# Altium schematic sheet DRS4.SchDoc: My title
size A3; Organization: University of California; Address1: 475 Portola Plaza; Address2: Los Angeles, CA 90095; Revision: R01; SheetNumber: 1; SheetTotal: 1
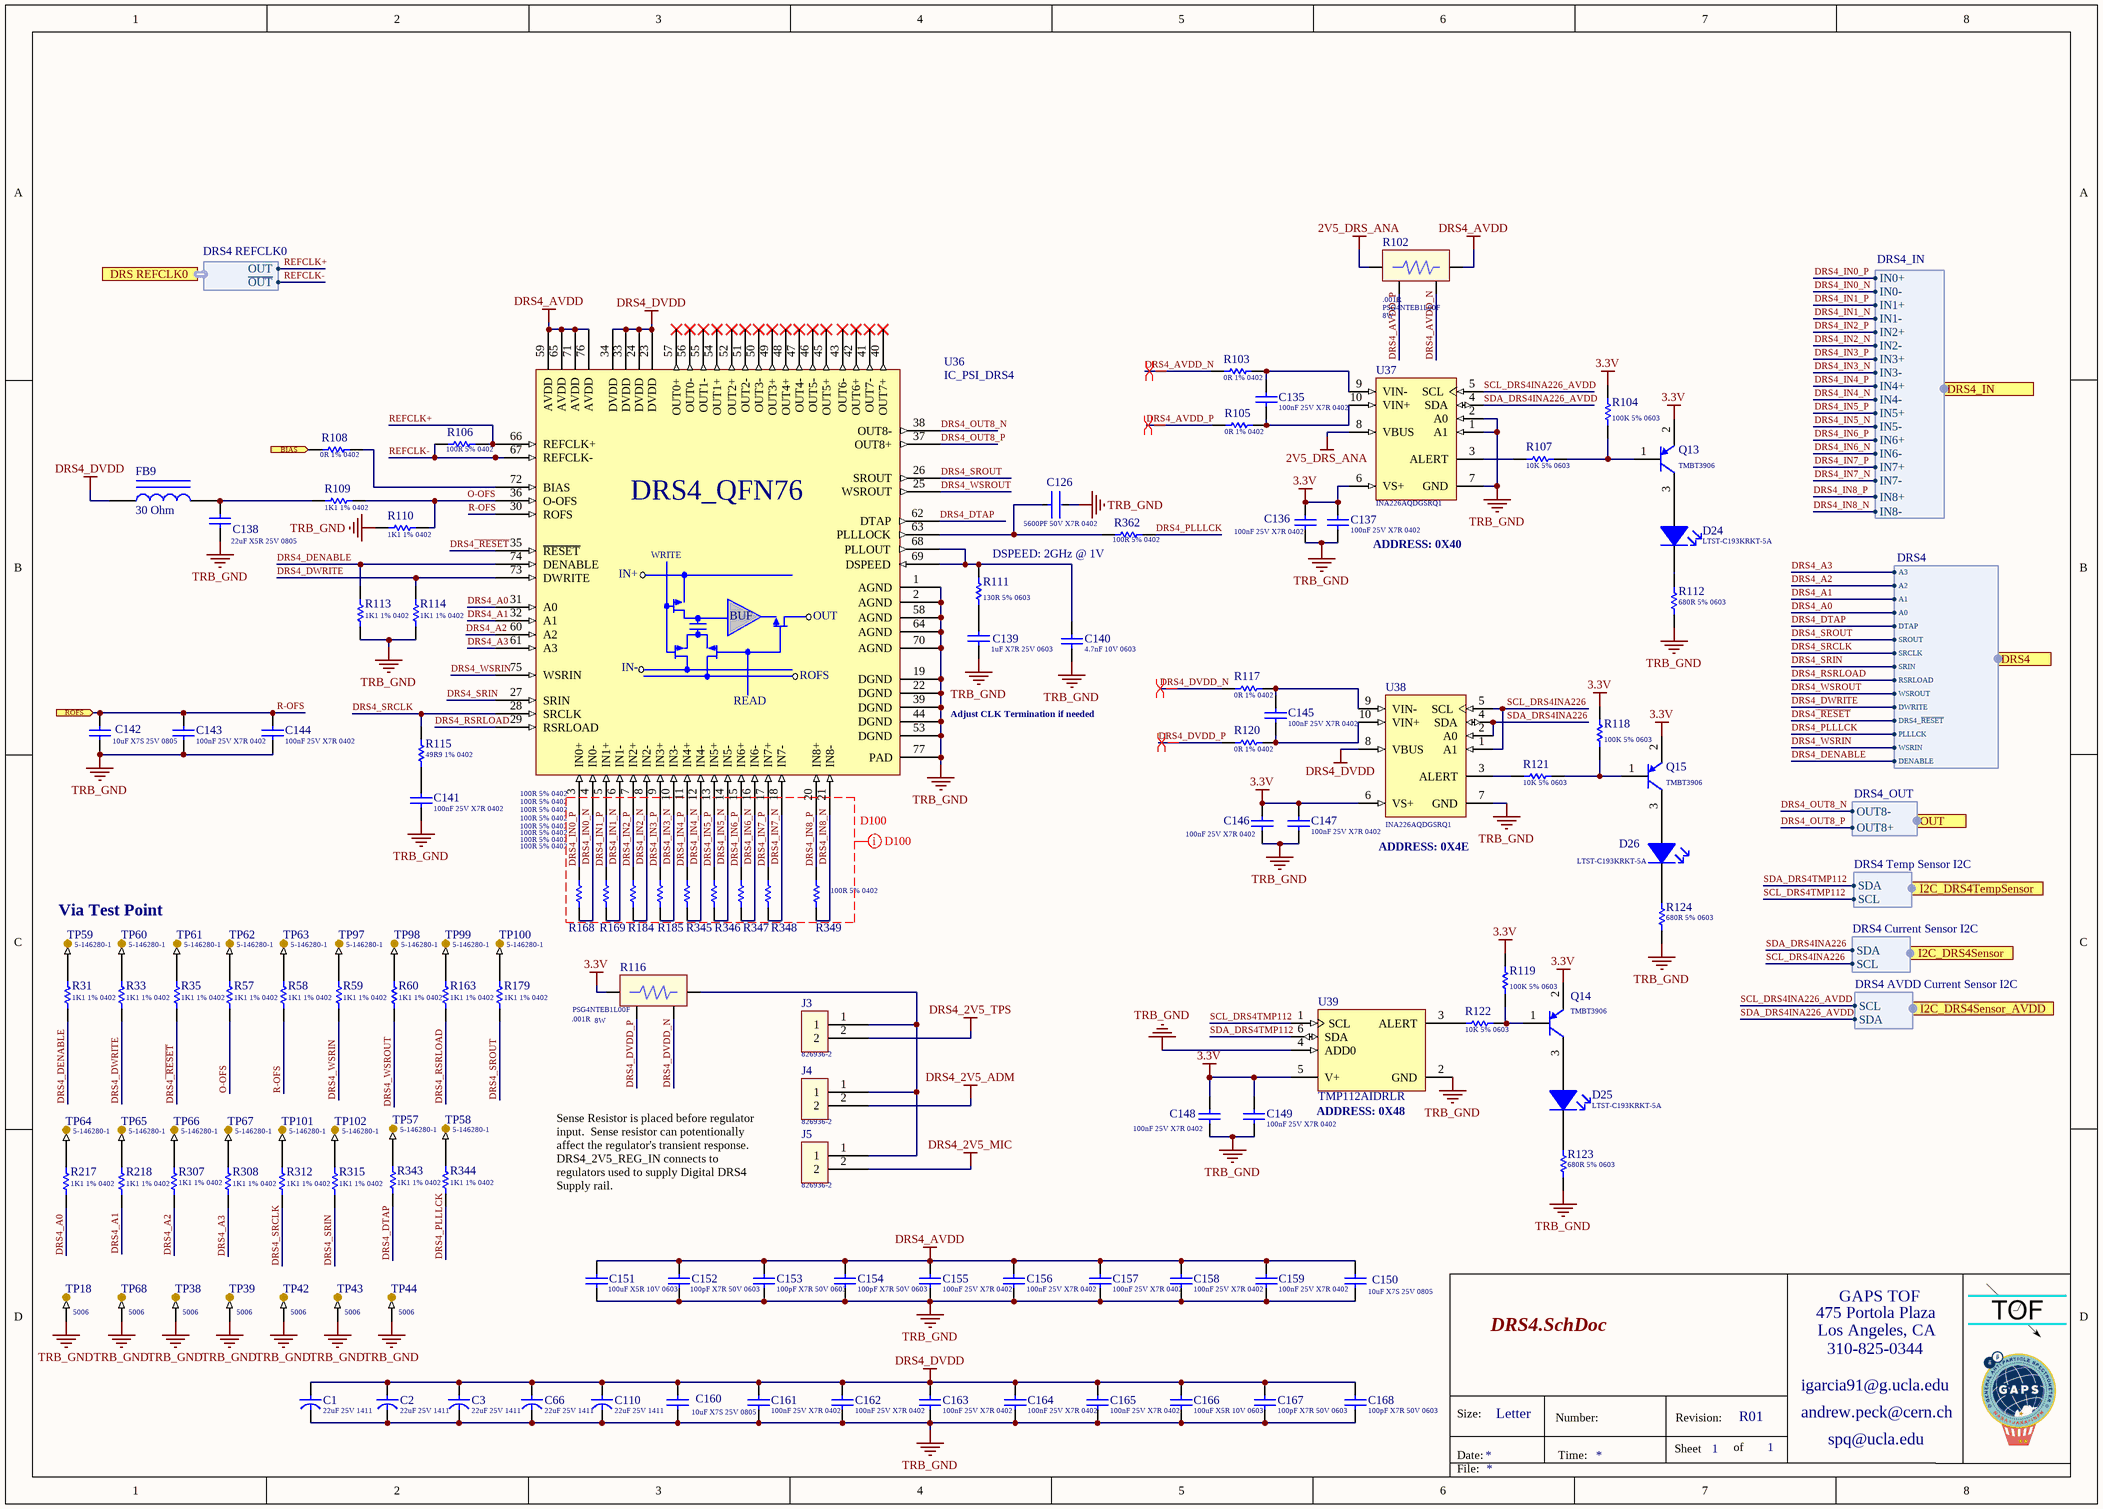
[diagram p0: DRS4.SchDoc]

## Parts
C1  Capacitance: 22uF 25V 1411  [Cap_Kemet_T521B226M025ATE100_22uF]  (hidden comment: Cap_Kemet_T521B226M025ATE100_22uF)
C2  Capacitance: 22uF 25V 1411  [Cap_Kemet_T521B226M025ATE100_22uF]  (hidden comment: Cap_Kemet_T521B226M025ATE100_22uF)
C3  Capacitance: 22uF 25V 1411  [Cap_Kemet_T521B226M025ATE100_22uF]  (hidden comment: Cap_Kemet_T521B226M025ATE100_22uF)
C66  Capacitance: 22uF 25V 1411  [Cap_Kemet_T521B226M025ATE100_22uF]  (hidden comment: Cap_Kemet_T521B226M025ATE100_22uF)
C110  Capacitance: 22uF 25V 1411  [Cap_Kemet_T521B226M025ATE100_22uF]  (hidden comment: Cap_Kemet_T521B226M025ATE100_22uF)
C126  5600PF 50V X7R 0402  [FP-C0402-BB-MFG]
C135  Capacitance: 100nF 25V X7R 0402  [Cap_Taiyo_Yuden_TMK105B7104KV-FR_100nF]  (hidden comment: Cap_Taiyo_Yuden_TMK105B7104KV-FR_100nF)
C136  Capacitance: 100nF 25V X7R 0402  [Cap_Taiyo_Yuden_TMK105B7104KV-FR_100nF]  (hidden comment: Cap_Taiyo_Yuden_TMK105B7104KV-FR_100nF)
C137  Capacitance: 100nF 25V X7R 0402  [Cap_Taiyo_Yuden_TMK105B7104KV-FR_100nF]  (hidden comment: Cap_Taiyo_Yuden_TMK105B7104KV-FR_100nF)
C138  Capacitance: 22uF X5R 25V 0805  [Cap_Murata_GRT21BR61E226ME13L_22uF]  (hidden comment: Cap_Murata_GRT21BR61E226ME13L_22uF)
C139  Capacitance: 1uF X7R 25V 0603  [Cap_Murata_GCJ188R71E105KA01J_1uF]  (hidden comment: Cap_Murata_GCJ188R71E105KA01J_1uF)
C140  4.7nF 10V 0603  [CAPC0603(1608)100_L]
C141  Capacitance: 100nF 25V X7R 0402  [Cap_Taiyo_Yuden_TMK105B7104KV-FR_100nF]  (hidden comment: Cap_Taiyo_Yuden_TMK105B7104KV-FR_100nF)
C142  Capacitance: 10uF X7S 25V 0805  [Cap_Murata_ GRM21BC71E106ME11L_10uF]  (hidden comment: Cap_Murata_ GRM21BC71E106ME11L_10uF)
C143  Capacitance: 100nF 25V X7R 0402  [Cap_Taiyo_Yuden_TMK105B7104KV-FR_100nF]  (hidden comment: Cap_Taiyo_Yuden_TMK105B7104KV-FR_100nF)
C144  Capacitance: 100nF 25V X7R 0402  [Cap_Taiyo_Yuden_TMK105B7104KV-FR_100nF]  (hidden comment: Cap_Taiyo_Yuden_TMK105B7104KV-FR_100nF)
C145  Capacitance: 100nF 25V X7R 0402  [Cap_Taiyo_Yuden_TMK105B7104KV-FR_100nF]  (hidden comment: Cap_Taiyo_Yuden_TMK105B7104KV-FR_100nF)
C146  Capacitance: 100nF 25V X7R 0402  [Cap_Taiyo_Yuden_TMK105B7104KV-FR_100nF]  (hidden comment: Cap_Taiyo_Yuden_TMK105B7104KV-FR_100nF)
C147  Capacitance: 100nF 25V X7R 0402  [Cap_Taiyo_Yuden_TMK105B7104KV-FR_100nF]  (hidden comment: Cap_Taiyo_Yuden_TMK105B7104KV-FR_100nF)
C148  Capacitance: 100nF 25V X7R 0402  [Cap_Taiyo_Yuden_TMK105B7104KV-FR_100nF]  (hidden comment: Cap_Taiyo_Yuden_TMK105B7104KV-FR_100nF)
C149  Capacitance: 100nF 25V X7R 0402  [Cap_Taiyo_Yuden_TMK105B7104KV-FR_100nF]  (hidden comment: Cap_Taiyo_Yuden_TMK105B7104KV-FR_100nF)
C150  Capacitance: 10uF X7S 25V 0805  [Cap_Murata_ GRM21BC71E106ME11L_10uF]  (hidden comment: Cap_Murata_ GRM21BC71E106ME11L_10uF)
C151  Capacitance: 100uF X5R 10V 0603  [Cap_Murata_GRM31CR61A107ME05L_100uF]  (hidden comment: Cap_Murata_GRM31CR61A107ME05L_100uF)
C152  Capacitance: 100pF X7R 50V 0603  [Cap_Kemet_C0603C101J5RACTU_100pF]  (hidden comment: Cap_Kemet_C0603C101J5RACTU_100pF)
C153  Capacitance: 100pF X7R 50V 0603  [Cap_Kemet_C0603C101J5RACTU_100pF]  (hidden comment: Cap_Kemet_C0603C101J5RACTU_100pF)
C154  Capacitance: 100pF X7R 50V 0603  [Cap_Kemet_C0603C101J5RACTU_100pF]  (hidden comment: Cap_Kemet_C0603C101J5RACTU_100pF)
C155  Capacitance: 100nF 25V X7R 0402  [Cap_Taiyo_Yuden_TMK105B7104KV-FR_100nF]  (hidden comment: Cap_Taiyo_Yuden_TMK105B7104KV-FR_100nF)
C156  Capacitance: 100nF 25V X7R 0402  [Cap_Taiyo_Yuden_TMK105B7104KV-FR_100nF]  (hidden comment: Cap_Taiyo_Yuden_TMK105B7104KV-FR_100nF)
C157  Capacitance: 100nF 25V X7R 0402  [Cap_Taiyo_Yuden_TMK105B7104KV-FR_100nF]  (hidden comment: Cap_Taiyo_Yuden_TMK105B7104KV-FR_100nF)
C158  Capacitance: 100nF 25V X7R 0402  [Cap_Taiyo_Yuden_TMK105B7104KV-FR_100nF]  (hidden comment: Cap_Taiyo_Yuden_TMK105B7104KV-FR_100nF)
C159  Capacitance: 100nF 25V X7R 0402  [Cap_Taiyo_Yuden_TMK105B7104KV-FR_100nF]  (hidden comment: Cap_Taiyo_Yuden_TMK105B7104KV-FR_100nF)
C160  Capacitance: 10uF X7S 25V 0805  [Cap_Murata_ GRM21BC71E106ME11L_10uF]  (hidden comment: Cap_Murata_ GRM21BC71E106ME11L_10uF)
C161  Capacitance: 100nF 25V X7R 0402  [Cap_Taiyo_Yuden_TMK105B7104KV-FR_100nF]  (hidden comment: Cap_Taiyo_Yuden_TMK105B7104KV-FR_100nF)
C162  Capacitance: 100nF 25V X7R 0402  [Cap_Taiyo_Yuden_TMK105B7104KV-FR_100nF]  (hidden comment: Cap_Taiyo_Yuden_TMK105B7104KV-FR_100nF)
C163  Capacitance: 100nF 25V X7R 0402  [Cap_Taiyo_Yuden_TMK105B7104KV-FR_100nF]  (hidden comment: Cap_Taiyo_Yuden_TMK105B7104KV-FR_100nF)
C164  Capacitance: 100nF 25V X7R 0402  [Cap_Taiyo_Yuden_TMK105B7104KV-FR_100nF]  (hidden comment: Cap_Taiyo_Yuden_TMK105B7104KV-FR_100nF)
C165  Capacitance: 100nF 25V X7R 0402  [Cap_Taiyo_Yuden_TMK105B7104KV-FR_100nF]  (hidden comment: Cap_Taiyo_Yuden_TMK105B7104KV-FR_100nF)
C166  Capacitance: 100uF X5R 10V 0603  [Cap_Murata_GRM31CR61A107ME05L_100uF]  (hidden comment: Cap_Murata_GRM31CR61A107ME05L_100uF)
C167  Capacitance: 100pF X7R 50V 0603  [Cap_Kemet_C0603C101J5RACTU_100pF]  (hidden comment: Cap_Kemet_C0603C101J5RACTU_100pF)
C168  Capacitance: 100pF X7R 50V 0603  [Cap_Kemet_C0603C101J5RACTU_100pF]  (hidden comment: Cap_Kemet_C0603C101J5RACTU_100pF)
D24  LTST-C193KRKT-5A  [Led_Lite-On_LTST-C193KGKT-5A_Red]
D25  LTST-C193KRKT-5A  [Led_Lite-On_LTST-C193KGKT-5A_Red]
D26  LTST-C193KRKT-5A  [Led_Lite-On_LTST-C193KGKT-5A_Red]
FB9  30 Ohm  [Feb_MURATA_BLM15AX300SZ1D_30]
J3  Series: 826936-2  [Header_TE_Connectivity_826936-2_2POS_5A]  (hidden comment: Header_TE_Connectivity_826936-2_2POS_5A)
J4  Series: 826936-2  [Header_TE_Connectivity_826936-2_2POS_5A]  (hidden comment: Header_TE_Connectivity_826936-2_2POS_5A)
J5  Series: 826936-2  [Header_TE_Connectivity_826936-2_2POS_5A]  (hidden comment: Header_TE_Connectivity_826936-2_2POS_5A)
Q13  Series: TMBT3906  [BJT_PNP_Toshiba_TMBT3906]  (hidden comment: BJT_PNP_Toshiba_TMBT3906)
Q14  Series: TMBT3906  [BJT_PNP_Toshiba_TMBT3906]  (hidden comment: BJT_PNP_Toshiba_TMBT3906)
Q15  Series: TMBT3906  [BJT_PNP_Toshiba_TMBT3906]  (hidden comment: BJT_PNP_Toshiba_TMBT3906)
R31  1K1 1% 0402  [RESC0402(1005)_L]
R33  1K1 1% 0402  [RESC0402(1005)_L]
R35  1K1 1% 0402  [RESC0402(1005)_L]
R57  1K1 1% 0402  [RESC0402(1005)_L]
R58  1K1 1% 0402  [RESC0402(1005)_L]
R59  1K1 1% 0402  [RESC0402(1005)_L]
R60  1K1 1% 0402  [RESC0402(1005)_L]
R102  Resistance: .001R  Series: PSG4NTEB1L00F  Parameter 1: 8W  [SRes_KOA_PSG4NTEB1L00F_1mOhm]  (hidden comment: SRes_KOA_PSG4NTEB1L00F_1mOhm)
R103  Resistance: 0R 1% 0402  [Res_Vishay_CRCW04020000Z0EDC_0_Ohm]  (hidden comment: Res_Vishay_CRCW04020000Z0EDC_0_Ohm)
R104  100K 5% 0603  [RESC0603(1608)_N]
R105  Resistance: 0R 1% 0402  [Res_Vishay_CRCW04020000Z0EDC_0_Ohm]  (hidden comment: Res_Vishay_CRCW04020000Z0EDC_0_Ohm)
R106  100R 5% 0402  [RESC0402(1005)_L]
R107  10K 5% 0603  [RESC0603(1608)_L]
R108  Resistance: 0R 1% 0402  [Res_Vishay_CRCW04020000Z0EDC_0_Ohm]  (hidden comment: Res_Vishay_CRCW04020000Z0EDC_0_Ohm)
R109  1K1 1% 0402  [RESC0402(1005)_L]
R110  1K1 1% 0402  [RESC0402(1005)_L]
R111  130R 5% 0603  [RESC0603(1608)_L]
R112  680R 5% 0603  [RESC0603(1608)_L]
R113  1K1 1% 0402  [RESC0402(1005)_L]
R114  1K1 1% 0402  [RESC0402(1005)_L]
R115  49R9 1% 0402  [RESC0402(1005)_L]
R116  Resistance: .001R  Series: PSG4NTEB1L00F  Parameter 1: 8W  [SRes_KOA_PSG4NTEB1L00F_1mOhm]  (hidden comment: SRes_KOA_PSG4NTEB1L00F_1mOhm)
R117  Resistance: 0R 1% 0402  [Res_Vishay_CRCW04020000Z0EDC_0_Ohm]  (hidden comment: Res_Vishay_CRCW04020000Z0EDC_0_Ohm)
R118  100K 5% 0603  [RESC0603(1608)_N]
R119  100K 5% 0603  [RESC0603(1608)_N]
R120  Resistance: 0R 1% 0402  [Res_Vishay_CRCW04020000Z0EDC_0_Ohm]  (hidden comment: Res_Vishay_CRCW04020000Z0EDC_0_Ohm)
R121  10K 5% 0603  [RESC0603(1608)_L]
R122  10K 5% 0603  [RESC0603(1608)_L]
R123  680R 5% 0603  [RESC0603(1608)_L]
R124  680R 5% 0603  [RESC0603(1608)_L]
R163  1K1 1% 0402  [RESC0402(1005)_L]
R168  100R 5% 0402  [RESC0402(1005)_L]
R169  100R 5% 0402  [RESC0402(1005)_L]
R179  1K1 1% 0402  [RESC0402(1005)_L]
R184  100R 5% 0402  [RESC0402(1005)_L]
R185  100R 5% 0402  [RESC0402(1005)_L]
R217  1K1 1% 0402  [RESC0402(1005)_L]
R218  1K1 1% 0402  [RESC0402(1005)_L]
R307  1K1 1% 0402  [RESC0402(1005)_L]
R308  1K1 1% 0402  [RESC0402(1005)_L]
R312  1K1 1% 0402  [RESC0402(1005)_L]
R315  1K1 1% 0402  [RESC0402(1005)_L]
R343  1K1 1% 0402  [RESC0402(1005)_L]
R344  1K1 1% 0402  [RESC0402(1005)_L]
R345  100R 5% 0402  [RESC0402(1005)_L]
R346  100R 5% 0402  [RESC0402(1005)_L]
R347  100R 5% 0402  [RESC0402(1005)_L]
R348  100R 5% 0402  [RESC0402(1005)_L]
R349  100R 5% 0402  [RESC0402(1005)_L]
R362  100R 5% 0402  [RESC0402(1005)_L]
TP18  Series: 5006  [TP_Keystone_Electronics_5006]  (hidden comment: TP_Keystone_Electronics_5006)
TP38  Series: 5006  [TP_Keystone_Electronics_5006]  (hidden comment: TP_Keystone_Electronics_5006)
TP39  Series: 5006  [TP_Keystone_Electronics_5006]  (hidden comment: TP_Keystone_Electronics_5006)
TP42  Series: 5006  [TP_Keystone_Electronics_5006]  (hidden comment: TP_Keystone_Electronics_5006)
TP43  Series: 5006  [TP_Keystone_Electronics_5006]  (hidden comment: TP_Keystone_Electronics_5006)
TP44  Series: 5006  [TP_Keystone_Electronics_5006]  (hidden comment: TP_Keystone_Electronics_5006)
TP57  Series: 5-146280-1  [TP_TE_Connectivity_5-146280-1_1POS]  (hidden comment: TP_TE_Connectivity_5-146280-1_1POS)
TP58  Series: 5-146280-1  [TP_TE_Connectivity_5-146280-1_1POS]  (hidden comment: TP_TE_Connectivity_5-146280-1_1POS)
TP59  Series: 5-146280-1  [TP_TE_Connectivity_5-146280-1_1POS]  (hidden comment: TP_TE_Connectivity_5-146280-1_1POS)
TP60  Series: 5-146280-1  [TP_TE_Connectivity_5-146280-1_1POS]  (hidden comment: TP_TE_Connectivity_5-146280-1_1POS)
TP61  Series: 5-146280-1  [TP_TE_Connectivity_5-146280-1_1POS]  (hidden comment: TP_TE_Connectivity_5-146280-1_1POS)
TP62  Series: 5-146280-1  [TP_TE_Connectivity_5-146280-1_1POS]  (hidden comment: TP_TE_Connectivity_5-146280-1_1POS)
TP63  Series: 5-146280-1  [TP_TE_Connectivity_5-146280-1_1POS]  (hidden comment: TP_TE_Connectivity_5-146280-1_1POS)
TP64  Series: 5-146280-1  [TP_TE_Connectivity_5-146280-1_1POS]  (hidden comment: TP_TE_Connectivity_5-146280-1_1POS)
TP65  Series: 5-146280-1  [TP_TE_Connectivity_5-146280-1_1POS]  (hidden comment: TP_TE_Connectivity_5-146280-1_1POS)
TP66  Series: 5-146280-1  [TP_TE_Connectivity_5-146280-1_1POS]  (hidden comment: TP_TE_Connectivity_5-146280-1_1POS)
TP67  Series: 5-146280-1  [TP_TE_Connectivity_5-146280-1_1POS]  (hidden comment: TP_TE_Connectivity_5-146280-1_1POS)
TP68  Series: 5006  [TP_Keystone_Electronics_5006]  (hidden comment: TP_Keystone_Electronics_5006)
TP97  Series: 5-146280-1  [TP_TE_Connectivity_5-146280-1_1POS]  (hidden comment: TP_TE_Connectivity_5-146280-1_1POS)
TP98  Series: 5-146280-1  [TP_TE_Connectivity_5-146280-1_1POS]  (hidden comment: TP_TE_Connectivity_5-146280-1_1POS)
TP99  Series: 5-146280-1  [TP_TE_Connectivity_5-146280-1_1POS]  (hidden comment: TP_TE_Connectivity_5-146280-1_1POS)
TP100  Series: 5-146280-1  [TP_TE_Connectivity_5-146280-1_1POS]  (hidden comment: TP_TE_Connectivity_5-146280-1_1POS)
TP101  Series: 5-146280-1  [TP_TE_Connectivity_5-146280-1_1POS]  (hidden comment: TP_TE_Connectivity_5-146280-1_1POS)
TP102  Series: 5-146280-1  [TP_TE_Connectivity_5-146280-1_1POS]  (hidden comment: TP_TE_Connectivity_5-146280-1_1POS)
U36  IC_PSI_DRS4  [DRS4]
U37  INA226AQDGSRQ1  [INA226AQDGSRQ1]
U38  INA226AQDGSRQ1  [INA226AQDGSRQ1]
U39  TMP112AIDRLR  [TMP112AIDRLR]

## Ports
BIAS (in), DRS4 (harness DRS4), DRS4_IN (harness DRS4_IN), DRS REFCLK0 (harness DRS4 REFCLK0), I2C_DRS4Sensor (harness DRS4 Current Sensor I2C), I2C_DRS4Sensor_AVDD (harness DRS4 AVDD Current Sensor I2C), I2C_DRS4TempSensor (harness DRS4 Temp Sensor I2C), OUT (harness DRS4_OUT), ROFS (in)

## Harnesses
DRS4: A3, A2, A1, A0, DTAP, SROUT, SRCLK, SRIN, RSRLOAD, WSROUT, DWRITE, DRS4_~{RESET}, PLLLCK, WSRIN, DENABLE
DRS4_IN: IN0+, IN0-, IN1+, IN1-, IN2+, IN2-, IN3+, IN3-, IN4+, IN4-, IN5+, IN5-, IN6+, IN6-, IN7+, IN7-, IN8+, IN8-
DRS4_OUT: OUT8+, OUT8-
DRS4 REFCLK0: OUT, ~{OUT}
DRS4 Temp Sensor I2C: SCL, SDA
DRS4 Current Sensor I2C: SCL, SDA
DRS4 AVDD Current Sensor I2C: SCL, SDA

## Nets
2V5_DRS_ANA: R102.1 U37.8(VBUS)
3.3V: C136.2 C137.2 C146.2 C147.2 C148.2 C149.2 Q13.2(E) Q14.2(E) Q15.2(E) R104.2 R116.1 R118.2 R119.2 U37.6(VS+) U38.6(VS+) U39.5(V+)
DRS4_2V5_ADM: J4.2
DRS4_2V5_MIC: J5.2
DRS4_2V5_TPS: J3.2
DRS4_AVDD: C150.1 C151.2 C152.1 C153.1 C154.1 C155.2 C156.2 C157.2 C158.2 C159.2 R102.2 U36.59(AVDD) U36.65(AVDD) U36.71(AVDD) U36.76(AVDD)
DRS4_DVDD: C1.1 C2.1 C3.1 C66.1 C110.1 C160.1 C161.2 C162.2 C163.2 C164.2 C165.2 C166.2 C167.1 C168.1 FB9.1 U36.23(DVDD) U36.24(DVDD) U36.33(DVDD) U36.34(DVDD) U38.8(VBUS)
TRB_GND: C1.2 C2.2 C3.2 C66.2 C110.2 C126.2 C136.1 C137.1 C138.1 C139.1 C140.1 C141.1 C142.2 C143.1 C144.1 C146.1 C147.1 C148.1 C149.1 C150.2 C151.1 C152.2 C153.2 C154.2 C155.1 C156.1 C157.1 C158.1 C159.1 C160.2 C161.1 C162.1 C163.1 C164.1 C165.1 C166.1 C167.2 C168.2 R110.2 R112.1 R113.1 R114.1 R123.1 R124.1 TP18.1 TP38.1 TP39.1 TP42.1 TP43.1 TP44.1 TP68.1 U36.1(AGND) U36.2(AGND) U36.19(DGND) U36.22(DGND) U36.39(DGND) U36.44(DGND) U36.53(DGND) U36.58(AGND) U36.64(AGND) U36.70(AGND) U36.77(PAD) U37.1(A1) U37.2(A0) U37.7(GND) U38.7(GND) U39.2(GND) U39.4(ADD0)
BIAS: R108.1 ; port BIAS
DRS4~{_RESET}: R35.1 U36.35(~{RESET}) ; port DRS4.DRS4_~{RESET}
DRS4_A0: R217.1 U36.31(A0) ; port DRS4.A0
DRS4_A1: R218.1 U36.32(A1) ; port DRS4.A1
DRS4_A2: R307.2 U36.60(A2) ; port DRS4.A2
DRS4_A3: R308.1 U36.61(A3) ; port DRS4.A3
DRS4_AVDD_N: R102.3 R103.1
DRS4_AVDD_P: R102.4 R105.1
DRS4_DENABLE: R31.1 R113.2 U36.74(DENABLE) ; port DRS4.DENABLE
DRS4_DTAP: R343.1 U36.62(DTAP) ; port DRS4.DTAP
DRS4_DVDD_N: R116.3 R117.1
DRS4_DVDD_P: R116.4 R120.1
DRS4_DWRITE: R33.1 R114.2 U36.73(DWRITE) ; port DRS4.DWRITE
DRS4_IN0_N: R168.2 U36.4(IN0-) ; port DRS4_IN.IN0-
DRS4_IN0_P: R168.1 U36.3(IN0+) ; port DRS4_IN.IN0+
DRS4_IN1_N: R169.2 U36.6(IN1-) ; port DRS4_IN.IN1-
DRS4_IN1_P: R169.1 U36.5(IN1+) ; port DRS4_IN.IN1+
DRS4_IN2_N: R184.2 U36.8(IN2-) ; port DRS4_IN.IN2-
DRS4_IN2_P: R184.1 U36.7(IN2+) ; port DRS4_IN.IN2+
DRS4_IN3_N: R185.2 U36.10(IN3-) ; port DRS4_IN.IN3-
DRS4_IN3_P: R185.1 U36.9(IN3+) ; port DRS4_IN.IN3+
DRS4_IN4_N: R345.2 U36.12(IN4-) ; port DRS4_IN.IN4-
DRS4_IN4_P: R345.1 U36.11(IN4+) ; port DRS4_IN.IN4+
DRS4_IN5_N: R346.2 U36.14(IN5-) ; port DRS4_IN.IN5-
DRS4_IN5_P: R346.1 U36.13(IN5+) ; port DRS4_IN.IN5+
DRS4_IN6_N: R347.2 U36.16(IN6-) ; port DRS4_IN.IN6-
DRS4_IN6_P: R347.1 U36.15(IN6+) ; port DRS4_IN.IN6+
DRS4_IN7_N: R348.2 U36.18(IN7-) ; port DRS4_IN.IN7-
DRS4_IN7_P: R348.1 U36.17(IN7+) ; port DRS4_IN.IN7+
DRS4_IN8_N: R349.2 U36.21(IN8-) ; port DRS4_IN.IN8-
DRS4_IN8_P: R349.1 U36.20(IN8+) ; port DRS4_IN.IN8+
DRS4_OUT8_N: U36.38(OUT8-) ; port OUT.OUT8-
DRS4_OUT8_P: U36.37(OUT8+) ; port OUT.OUT8+
DRS4_PLLLCK: R344.1 R362.1 ; port DRS4.PLLLCK
DRS4_RSRLOAD: R163.1 U36.29(RSRLOAD) ; port DRS4.RSRLOAD
DRS4_SRCLK: R115.1 R312.1 U36.28(SRCLK) ; port DRS4.SRCLK
DRS4_SRIN: R315.1 U36.27(SRIN) ; port DRS4.SRIN
DRS4_SROUT: R179.1 U36.26(SROUT) ; port DRS4.SROUT
DRS4_WSRIN: R59.1 U36.75(WSRIN) ; port DRS4.WSRIN
DRS4_WSROUT: R60.1 U36.25(WSROUT) ; port DRS4.WSROUT
O-OFS: R57.1 R109.1 R110.1 U36.36(O-OFS)
R-OFS: C142.1 C143.2 C144.2 R58.1 U36.30(ROFS) ; port ROFS
REFCLK+: R106.1 U36.66(REFCLK+) ; port DRS REFCLK0.OUT
REFCLK-: R106.2 U36.67(REFCLK-) ; port DRS REFCLK0.~{OUT}
SCL_DRS4INA226: U38.1(A1) U38.5(SCL) ; port I2C_DRS4Sensor.SCL
SCL_DRS4INA226_AVDD: U37.5(SCL) ; port I2C_DRS4Sensor_AVDD.SCL
SCL_DRS4TMP112: U39.1(SCL) ; port I2C_DRS4TempSensor.SCL
SDA_DRS4INA226: U38.2(A0) U38.4(SDA) ; port I2C_DRS4Sensor.SDA
SDA_DRS4INA226_AVDD: U37.4(SDA) ; port I2C_DRS4Sensor_AVDD.SDA
SDA_DRS4TMP112: U39.6(SDA) ; port I2C_DRS4TempSensor.SDA
NetC126_1: C126.1 R362.2 U36.63(PLLLOCK)
NetC135_1: C135.1 R105.2 U37.10(VIN+)
NetC135_2: C135.2 R103.2 U37.9(VIN-)
NetC138_2: C138.2 FB9.2 R109.2
NetC139_2: C139.2 R111.1
NetC140_2: C140.2 R111.2 U36.68(PLLOUT) U36.69(DSPEED)
NetC141_2: C141.2 R115.2
NetC145_1: C145.1 R120.2 U38.10(VIN+)
NetC145_2: C145.2 R117.2 U38.9(VIN-)
NetD24_1: D24.1(K) R112.2
NetD24_2: D24.2(A) Q13.3(C)
NetD25_1: D25.1(K) R123.2
NetD25_2: D25.2(A) Q14.3(C)
NetD26_1: D26.1(K) R124.2
NetD26_2: D26.2(A) Q15.3(C)
NetJ3_1: J3.1 J4.1 J5.1 R116.2
NetQ13_1: Q13.1(B) R104.1 R107.1
NetQ14_1: Q14.1(B) R119.1 R122.1
NetQ15_1: Q15.1(B) R118.1 R121.1
NetR31_2: R31.2 TP59.1
NetR33_2: R33.2 TP60.1
NetR35_2: R35.2 TP61.1
NetR57_2: R57.2 TP62.1
NetR58_2: R58.2 TP63.1
NetR59_2: R59.2 TP97.1
NetR60_2: R60.2 TP98.1
NetR107_2: R107.2 U37.3(ALERT)
NetR108_2: R108.2 U36.72(BIAS)
NetR121_2: R121.2 U38.3(ALERT)
NetR122_2: R122.2 U39.3(ALERT)
NetR163_2: R163.2 TP99.1
NetR179_2: R179.2 TP100.1
NetR217_2: R217.2 TP64.1
NetR218_2: R218.2 TP65.1
NetR307_1: R307.1 TP66.1
NetR308_2: R308.2 TP67.1
NetR312_2: R312.2 TP101.1
NetR315_2: R315.2 TP102.1
NetR343_2: R343.2 TP57.1
NetR344_2: R344.2 TP58.1

Not connected (* = marked no-connect by the designer): U36 40(OUT7+)* 41(OUT7-)* 42(OUT6+)* 43(OUT6-)* 45(OUT5+)* 46(OUT5-)* 47(OUT4-)* 48(OUT4+)* 49(OUT3+)* 50(OUT3-)* 51(OUT2-)* 52(OUT2+)* 54(OUT1+)* 55(OUT1-)* 56(OUT0-)* 57(OUT0+)*

## Layout directives
differential pair; differential pair class D100: DRS4_IN0_N, DRS4_IN0_P, DRS4_IN1_N, DRS4_IN1_P, DRS4_IN2_N, DRS4_IN2_P, DRS4_IN3_N, DRS4_IN3_P, DRS4_IN4_N, DRS4_IN4_P, DRS4_IN5_N, DRS4_IN5_P, DRS4_IN6_N, DRS4_IN6_P, DRS4_IN7_N, DRS4_IN7_P, DRS4_IN8_N, DRS4_IN8_P
differential pair: DRS4_AVDD_N, DRS4_AVDD_P, DRS4_DVDD_N, DRS4_DVDD_P

## Notes on the sheet
- DSPEED: 2GHz @ 1V
- ADDRESS: 0X40
- Adjust CLK Termination if needed
- (near U36) D100
- (near U38) ADDRESS: 0X4E
- Via Test Point
- (near U39) ADDRESS: 0X48
- Sense Resistor is placed before regulator input.  Sense resistor can potentionally affect the regulator's transient response. DRS4_2V5_REG_IN connects to regulators used to supply Digital DRS4 Supply rail.
- 475 Portola Plaza
- GAPS TOF
- igarcia91@g.ucla.edu
- Los Angeles, CA
- 310-825-0344
- Size:
- Date:
- Letter
- Number:
- Time:
- Sheet
- Revision:
- of
- andrew.peck@cern.ch
- spq@ucla.edu
- File:
- (in symbol DRS4) DRS4_QFN76; WRITE; IN+; BUF; OUT; IN-; READ

## Library data of the parts
C1-C3 C66 C110 = Cap_Kemet_T521B226M025ATE100_22uF: Tantalum Capacitors - Polymer SMD 25V 22uF 1311 20% ESR=100mOhms; Supplier Part Number 1: 80-T521B226M25ATE100; Supplier 1: Mouser
C126 = CMP-03020-007524-1: CAP CER 5600PF 50V X7R 0402 / C0402C562K5RACTU; Manufacturer: Kemet; Temperature Coefficient: 15%; Tolerance: 0.1; Material: Ceramic; Value: 5,600 pF; Temperature Characteristic: X7R; Device Class L3: Ceramic Capacitors; Height: 0.55mm; Temperature: -55°C to +125°C; Package: C0402-BB; Category: Cap; ComponentLink2Description: Datasheet; Device Class L2: Capacitors; Automotive: No; Device Class L1: Passive Components; Lead Free: Yes; ComponentLink2URL: https://content.kemet.com/datasheets/KEM_C1002_X7R_SMD.pdf; Digikey Description: CAP CER 5600PF 50V X7R 0402; Temperature Range High: +125°C; RoHS: TRUE; Octopart: https://octopart.com/c0402c562k5ractu-kemet-98458; Temperature Range Low: -55°C; Ipc Land Pattern Name: CAPC10050X50; Voltage Rating: 50 V; Mouser Description: Multilayer Ceramic Capacitors MLCC - SMD/SMT 50volts 5600pF X7R 10%; Manufacturer Part Number: C0402C562K5RACTU; Capacitance: 5,600 pF
C135-C137 C141 C143-C149 C155-C159 C161-C165 = Cap_Taiyo_Yuden_TMK105B7104KV-FR_100nF: CAP CER 100nF 25V X7R 0402; Supplier 1: Mouser; Supplier Part Number 1: 963-TMK105B7104KV-FR
C138 = Cap_Murata_GRT21BR61E226ME13L_22uF: CAP CER 22uF 25V X5R 0805; Supplier 1: Mouser; Supplier Part Number 1: 81-GRT21BR61E226ME3L
C139 = Cap_Murata_GCJ188R71E105KA01J_1uF: CAP CER 1uF 25V X7R 0603; Supplier 1: Mouser; Supplier Part Number 1: 81-GCJ188R71E105KA1J
C140 = CMP-1035-02189-1: CAP 4.7nF 10V ±10% 0603 (1608 Metric) Thickness 1mm SMD; Case-Metric: 1608; Tolerance: Â±10%; Case-EIA: 0603; Max Thickness: 1 mm; Technology: SMT; Rated Voltage: 10 V; Value: 4.7nF
C142 C150 C160 = Cap_Murata_ GRM21BC71E106ME11L_10uF: CAP CER 10uF 25V X7R 0805; Supplier 1: Mouser; Supplier Part Number 1: 81-GRM21BC71E106ME1L
C151 C166 = Cap_Murata_GRM31CR61A107ME05L_100uF: CAP CER 100uF 25V X5R 0603; Supplier Part Number 1: 81-GRM31CR61A107ME5L; Supplier 1: Mouser
C152-C154 C167 C168 = Cap_Kemet_C0603C101J5RACTU_100pF: CAP CER 100pF 50V X7R 0603; Supplier 1: Mouser; Supplier Part Number 1: 80-C0603C101J5R
D24-D26 = Led_Lite-On_LTST-C193KGKT-5A_Red: Standard LEDs - SMD Red 470nm 28mcd 20mA; Supplier 1: Mouser; Supplier Part Number 1: 859-LTSTC193KRKT5A; Series: LTST-C193KRKT-5A
FB9 = Feb_MURATA_BLM15AX300SZ1D_30: Feb SMD 30 OHM 25% 3/4W 0402; Supplier 1: Mouser; Supplier Part Number 1: 81-BLM15AX300SZ1D
J3-J5 = Header_TE_Connectivity_826936-2_2POS_5A: Headers & Wire Housings 2P SINGLE ROW 5A; Supplier Part Number 1: 571-826936-2; Supplier 1: Mouser
Q13-Q15 = BJT_PNP_Toshiba_TMBT3906: Bipolar Transistors - BJT Transistor for Low Freq. Amplification; Supplier 1: Mouser; Supplier Part Number 1: TMBT3906,LM
R31 R33 R35 R57-R60 R109 R110 R113 R114 R163 R179 R217 R218 R307 R308 R312 R315 R343 R344 = CMP-1011-00514-1: 1K1 0.063W 1% 0402 (1005 Metric)  SMD; Case-Metric: 1005; Case-EIA: 0402; Value: 1100.00 Ohm; Power: 0.063 W; Tolerance: 1 %; Technology: SMT
R102 R116 = SRes_KOA_PSG4NTEB1L00F_1mOhm: Current Sense Resistors - SMD 1mOhm 8W 1% 50ppm AEC-Q200 Power Shunt; Supplier 1: Mouser; Supplier Part Number 1: 660-PSG4NTEB1L00F
R103 R105 R108 R117 R120 = Res_Vishay_CRCW04020000Z0EDC_0_Ohm: 0R 0.062W 1% 0402 (1005 Metric)  SMD; Supplier 1: Mouser; Supplier Part Number 1: 71-CRCW04020000Z0EDC
R104 R118 R119 = CMP-1012-00122-1: 100K 0.1W 5% 0603 (1608 Metric)  SMD; Case-EIA: 0603; Value: 100000.00 Ohm; Case-Metric: 1608; Tolerance: 5 %; Power: 0.1 W; Technology: SMT
R106 R168 R169 R184 R185 R345-R349 R362 = CMP-1011-00050-1: 100R 0.063W 5% 0402 (1005 Metric)  SMD; Case-EIA: 0402; Value: 100.00 Ohm; Case-Metric: 1005; Tolerance: 5 %; Technology: SMT; Power: 0.063 W
R107 R121 R122 = CMP-1012-00098-1: 10K 0.1W 5% 0603 (1608 Metric)  SMD; Case-EIA: 0603; Value: 10000.00 Ohm; Case-Metric: 1608; Technology: SMT; Tolerance: 5 %; Power: 0.1 W
R111 = CMP-1012-00053-1: 130R 0.1W 5% 0603 (1608 Metric)  SMD; Case-Metric: 1608; Case-EIA: 0603; Value: 130.00 Ohm; Technology: SMT; Tolerance: 5 %; Power: 0.1 W
R112 R123 R124 = CMP-1012-00070-1: 680R 0.1W 5% 0603 (1608 Metric)  SMD; Case-EIA: 0603; Value: 680.00 Ohm; Case-Metric: 1608; Tolerance: 5 %; Technology: SMT; Power: 0.1 W
R115 = CMP-1011-00363-1: 49R9 0.063W 1% 0402 (1005 Metric)  SMD; Case-EIA: 0402; Case-Metric: 1005; Value: 49.90 Ohm; Power: 0.063 W; Technology: SMT; Tolerance: 1 %
TP18 TP38 TP39 TP42-TP44 TP68 = TP_Keystone_Electronics_5006: Circuit Board Hardware - PCB TEST POINT BLK .063; Supplier 1: Mouser; Supplier Part Number 1: 534-5006
TP57-TP67 TP97-TP102 = TP_TE_Connectivity_5-146280-1_1POS: Headers & Wire Housings Unshrouded 1 POS T/H; Supplier Part Number 1: 571-51462801; Supplier 1: Mouser
U36 = DRS4: DRS4 QFN76 DAQ Chip; Series: DRS4
U37 U38 = INA226AQDGSRQ1: Current & Power Monitors & Regulators Automotive, 36-V, Ultra-High Accuracy, Low-/High-Side, I2C Out Current/Power Monitor w/ Alert 10-VSSOP -40 to 125; Supplier 1: Mouser; Supplier Part Number 1: 595-INA226AQDGSRQ1
U39 = TMP112AIDRLR: Board Mount Temperature Sensors Hi-Prec Lo-Pwr Dig Temp Sensor; Supplier 1: Mouser; Supplier Part Number 1: 595-TMP112AIDRLR